# EAGLE design schema (EAGLE 6.1)
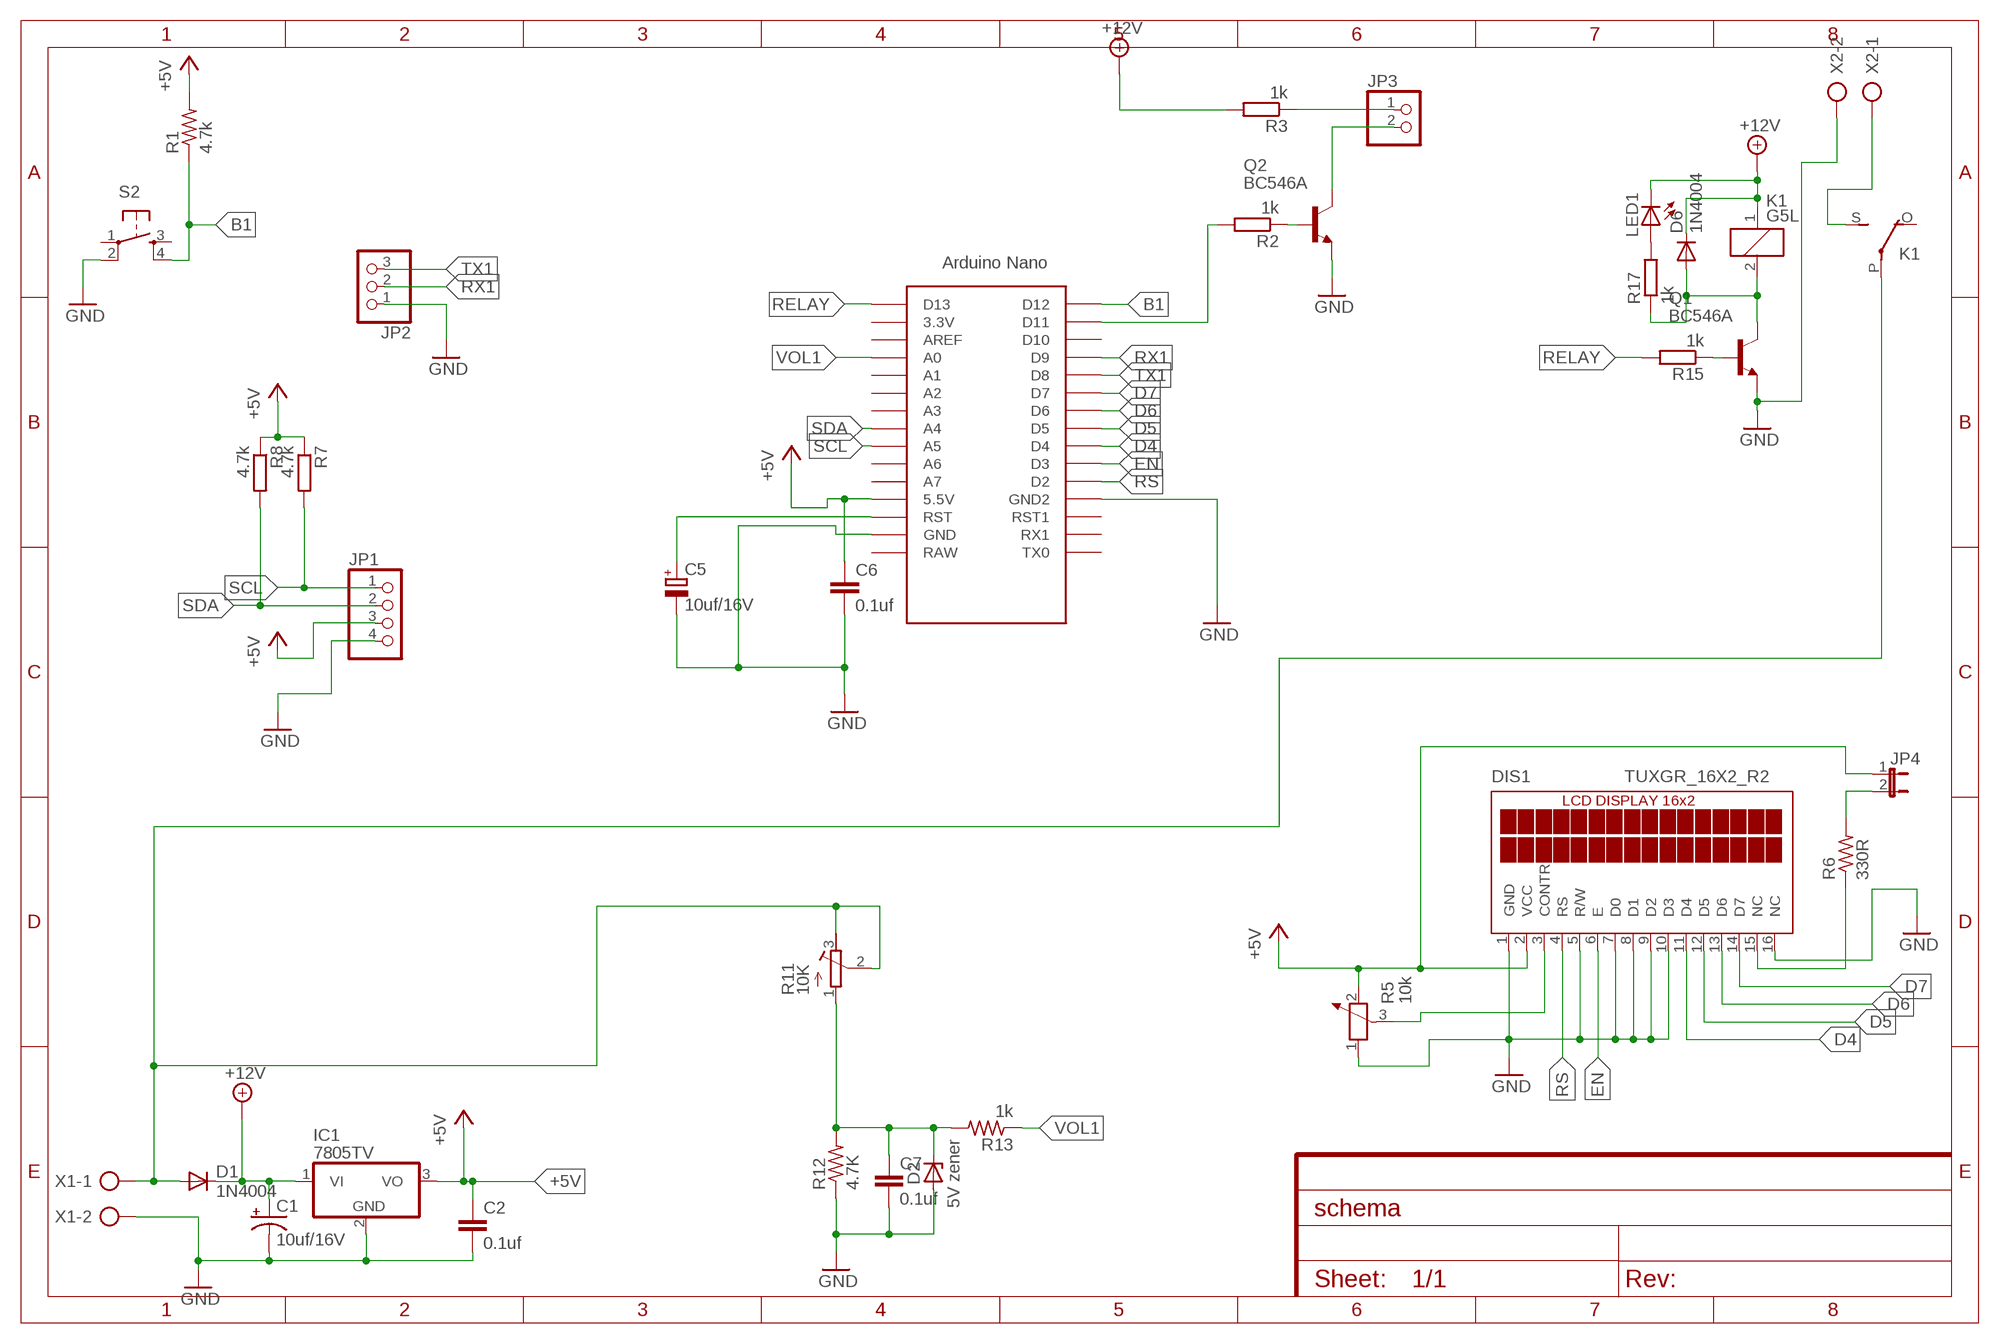
[diagram p0: schematic, sheet 1]

## Parts
C1  10uf/16V  CPOL-USE2.5-5  [E2,5-5]
C2  0.1uf  C-EU050-035X075  [C050-035X075]
C5  10uf/16V  CPOL-EUE2-5  [E2-5]
C6  0.1uf  C-EU050-035X075  [C050-035X075]
C7  0.1uf  C-EU050-025X075  [C050-025X075]
D1  1N4004  [DO41-10]
D2  1N4728  [DO41Z10]
D6  1N4004  [DO41-10]
DIS1  TUXGR_16X2_R2  [TUXGR_16X2_R2]
IC1  7805TV  [TO220V]
JP1  PINHD-1X4  [1X04]
JP2  PINHD-1X3  [1X03]
JP3  PINHD-1X2  [1X02]
JP4  JP1E  [JP1]
K1  G5L  [G5LE]
LED1  LED3MM  [LED3MM]
Q1  BC546A  [TO92-EBC]
Q2  BC546A  [TO92-EBC]
R1  4.7k  R-US_0207/10  [0207/10@1]
R2  1k  R-EU_0207/10  [0207/10@1]
R3  1k  R-EU_0207/10  [0207/10@1]
R5  10k  POTENTIOMETER_PT-10  [PT-10]
R6  330R  R-US_0207/10  [0207/10@1]
R7  4.7k  R-EU_0207/10  [0207/10@1]
R8  4.7k  R-EU_0207/10  [0207/10@1]
R11  10K  R-TRIMM3299W  [RTRIM3299W]
R12  4.7K  R-US_0207/10  [0207/10@1]
R13  1k  R-US_0207/10  [0207/10@1]
R15  1k  R-EU_0207/10  [0207/10@1]
R17  1k  R-EU_0207/5V  [0207/5V@1]
S2  TAC_SWITCHPTH  [TACTILE-PTH]
U$1  NANO  [NANO]
X1  AK500/2  [AK500/2]
X2  AK500/2  [AK500/2]

## Nets
+5V: C2.1 C6.1 DIS1.2(VCC) IC1.3(VO) JP1.3 JP4.1 R1.2 R5.2 R7.1 R8.1 U$1.5V(5.5V)
+12V: C1.+ D1.C D6.C IC1.1(VI) K1.1 LED1.K(C) R3.2
B1: R1.1 S2.4 U$1.D12
D4: DIS1.11(D4) U$1.D4
D5: DIS1.12(D5) U$1.D5
D6: DIS1.13(D6) U$1.D6
D7: DIS1.14(D7) U$1.D7
EN: DIS1.6(E) U$1.D3
FEEDER: D1.A K1.P(2:P) R11.2(S) R11.3(E) X1.1
GND: C1.- C2.2 C5.- C6.2 C7.2 D2.A DIS1.1(GND) DIS1.5(R/W) DIS1.7(D0) DIS1.8(D1) DIS1.9(D2) DIS1.10(D3) DIS1.16(NC) IC1.2(GND) JP1.4 JP2.1 Q1.E Q2.E R5.1 R12.1 S2.2 U$1.GND U$1.GND1(GND2) X1.2 X2.2
N$1: JP4.2 R6.2
N$2: D6.A K1.2 Q1.C R17.1
N$4: K1.S(2:S) X2.1
N$5: C7.1 D2.C R11.1(A) R12.2 R13.2
N$6: C5.+ U$1.RST
N$7: JP3.2 Q2.C
N$8: Q2.B R2.1
N$9: JP3.1 R3.1
N$10: DIS1.3(CONTR) R5.3
N$11: DIS1.15(NC) R6.1
N$12: R2.2 U$1.D11
N$17: Q1.B R15.1
N$24: LED1.A R17.2
RELAY: R15.2 U$1.D13
RS: DIS1.4(RS) U$1.D2
RX1: JP2.2 U$1.D9
SCL: JP1.1 R7.2 U$1.A5
SDA: JP1.2 R8.2 U$1.A4
TX1: JP2.3 U$1.D8
VOL1: R13.1 U$1.A0
Unconnected: K1.O(2:O) S2.1 S2.3 U$1.3.3V U$1.A1 U$1.A2 U$1.A3 U$1.A6 U$1.A7 U$1.AREF U$1.D10 U$1.ICSP1 U$1.ICSP2 U$1.ICSP3 U$1.ICSP4 U$1.ICSP5 U$1.ICSP6 U$1.RAW U$1.RST1 U$1.RX1 U$1.TX0

## Notes on the sheet
- 5V zener

## Library data of the parts
C1 = rcl:CPOL-US: POLARIZED CAPACITOR, American symbol
C2 C6 C7 = rcl:C-EU: CAPACITOR, European symbol
C5 = rcl:CPOL-EU: POLARIZED CAPACITOR, European symbol
D1 D6 = diode:1N4004: DIODE general purpose rectifier, 1 A
D2 = diode:1N4728: Z DIODE 3.3 V, 1W, 5 percent; VALUE: 5V zener
DIS1 = display-lcd:TUXGR_16X2_R2: Tuxgraphics LCD display 16x2 characters reflective, without background light Source: tuxgr_12x2_r2.pdf; OC_FARNELL: unknown; OC_NEWARK: unknown
IC1 = linear:78*: Positive VOLTAGE REGULATOR Source: http://cache.national.com/ds/LM/LM78L05.pdf http://www.fairchildsemi.com/ds/LM/LM7805.pdf
JP1 = pinhead:PINHD-1X4: PIN HEADER
JP2 = pinhead:PINHD-1X3: PIN HEADER
JP3 = pinhead:PINHD-1X2: PIN HEADER
JP4 = jumper:JP1E: JUMPER
K1 = relay:G5L: RELAY 1 x switch, 10 A/120 V AC, 8 A/30 V ADC, Omron; OC_FARNELL: unknown; OC_NEWARK: unknown
LED1 = led:LED: LED OSRAM: - CHIPLED LG R971, LG N971, LY N971, LG Q971, LY Q971, LO R971, LY R971 LH N974, LH R974 LS Q976, LO Q976, LY Q976 LO Q996 - Hyper CHIPLED LW Q18S LB Q993, LB Q99A, LB R99A - SideLED LS A670, LO A670, LY A670, LG A670, LP A670 LB A673, LV A673, LT A673, LW A673 LH A674 LY A675 LS A676, LA A676, LO A676, LY A676, LW A676 LS A679, LY A679, LG A679 - Hyper Micro SIDELED® LS Y876, LA Y876, LO Y876, LY Y876 LT Y87S - SmartLED LW L88C, LW L88S LB L89C, LB L89S, LG L890 LS L89K, LO L89K, LY L89K LS L896, LA L896, LO L896, LY L896 - TOPLED LS T670, LO T670, LY T670, LG T670, LP T670 LSG T670, LSP T670, LSY T670, LOP T670, LYG T670 LG T671, LOG T671, LSG T671 LB T673, LV T673, LT T673, LW T673 LH T674 LS T676, LA T676, LO T676, LY T676, LB T676, LH T676, LSB T676, LW T676 LB T67C, LV T67C, LT T67C, LS T67K, LO T67K, LY T67K, LW E67C LS E67B, LA E67B, LO E67B, LY E67B, LB E67C, LV E67C, LT E67C LW T67C LS T679, LY T679, LG T679 LS T770, LO T770, LY T770, LG T770, LP T770 LB T773, LV T773, LT T773, LW T773 LH T774 LS E675, LA E675, LY E675, LS T675 LS T776, LA T776, LO T776, LY T776, LB T776 LHGB T686 LT T68C, LB T68C - Hyper Mini TOPLED® LB M676 - Mini TOPLED Santana® LG M470 LS M47K, LO M47K, LY M47K Source: http://www.osram.convergy.de LUXEON: - LUMILED® LXK2-PW12-R00, LXK2-PW12-S00, LXK2-PW14-U00, LXK2-PW14-V00 LXK2-PM12-R00, LXK2-PM12-S00, LXK2-PM14-U00 LXK2-PE12-Q00, LXK2-PE12-R00, LXK2-PE12-S00, LXK2-PE14-T00, LXK2-PE14-U00 LXK2-PB12-K00, LXK2-PB12-L00, LXK2-PB12-M00, LXK2-PB14-N00, LXK2-PB14-P00, LXK2-PB14-Q00 LXK2-PR12-L00, LXK2-PR12-M00, LXK2-PR14-Q00, LXK2-PR14-R00 LXK2-PD12-Q00, LXK2-PD12-R00, LXK2-PD12-S00 LXK2-PH12-R00, LXK2-PH12-S00 LXK2-PL12-P00, LXK2-PL12-Q00, LXK2-PL12-R00 Source: www.luxeon.com KINGBRIGHT: KA-3528ASYC Source: www.kingbright.com
Q1 Q2 = transistor-npn:BC546*: NPN Transistor
R1 R6 R12 R13 = rcl:R-US_: RESISTOR, American symbol
R2 R3 R7 R8 R15 R17 = rcl:R-EU_: RESISTOR, European symbol
R5 = rcl:POTENTIOMETER_: Potentiometer
R11 = rcl:R-TRIMM: Trimm resistor
S2 = SparkFun-Retired:TAC_SWITCH: Momentary Switch Button commonly used for reset or general input. Spark Fun Electronics SKU : COM-00097 SMT- SWCH-08247
U$1 = Arduino-clone:NANO: Arduino Nano
X1 X2 = con-ptr500:AK500/2: CONNECTOR; OC_FARNELL: unknown; OC_NEWARK: unknown

## Net classes
0 default: width 0.8 mm, drill 0.8 mm, clearance 1.2 mm

## Board
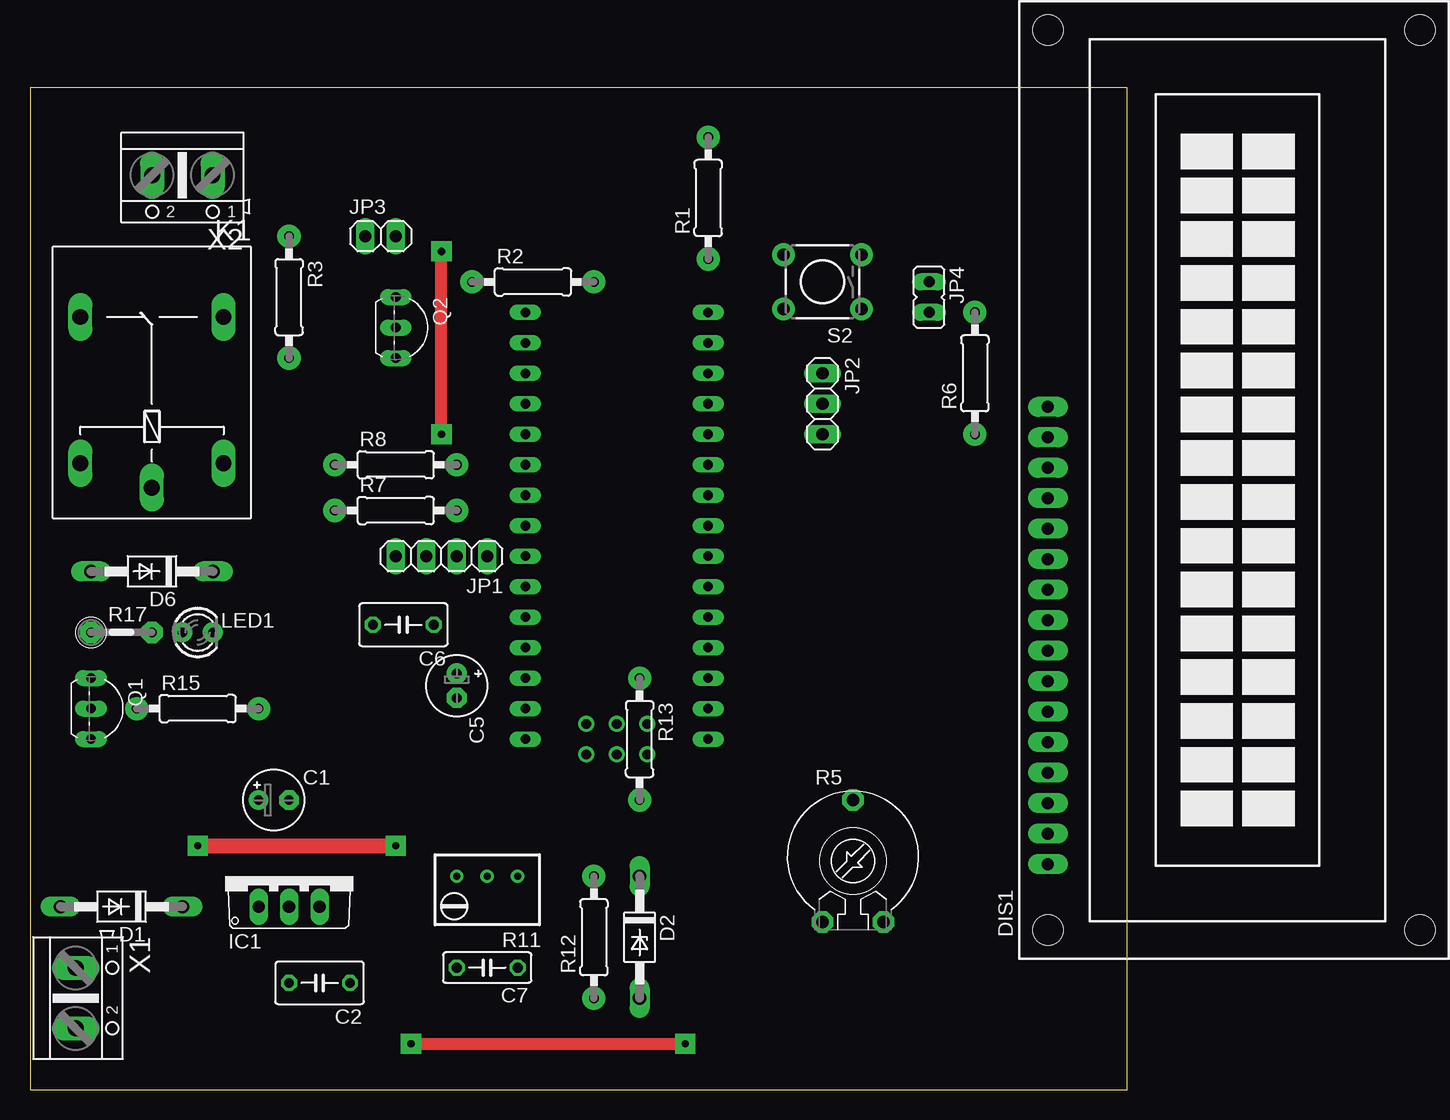
[diagram p1: board, top side]
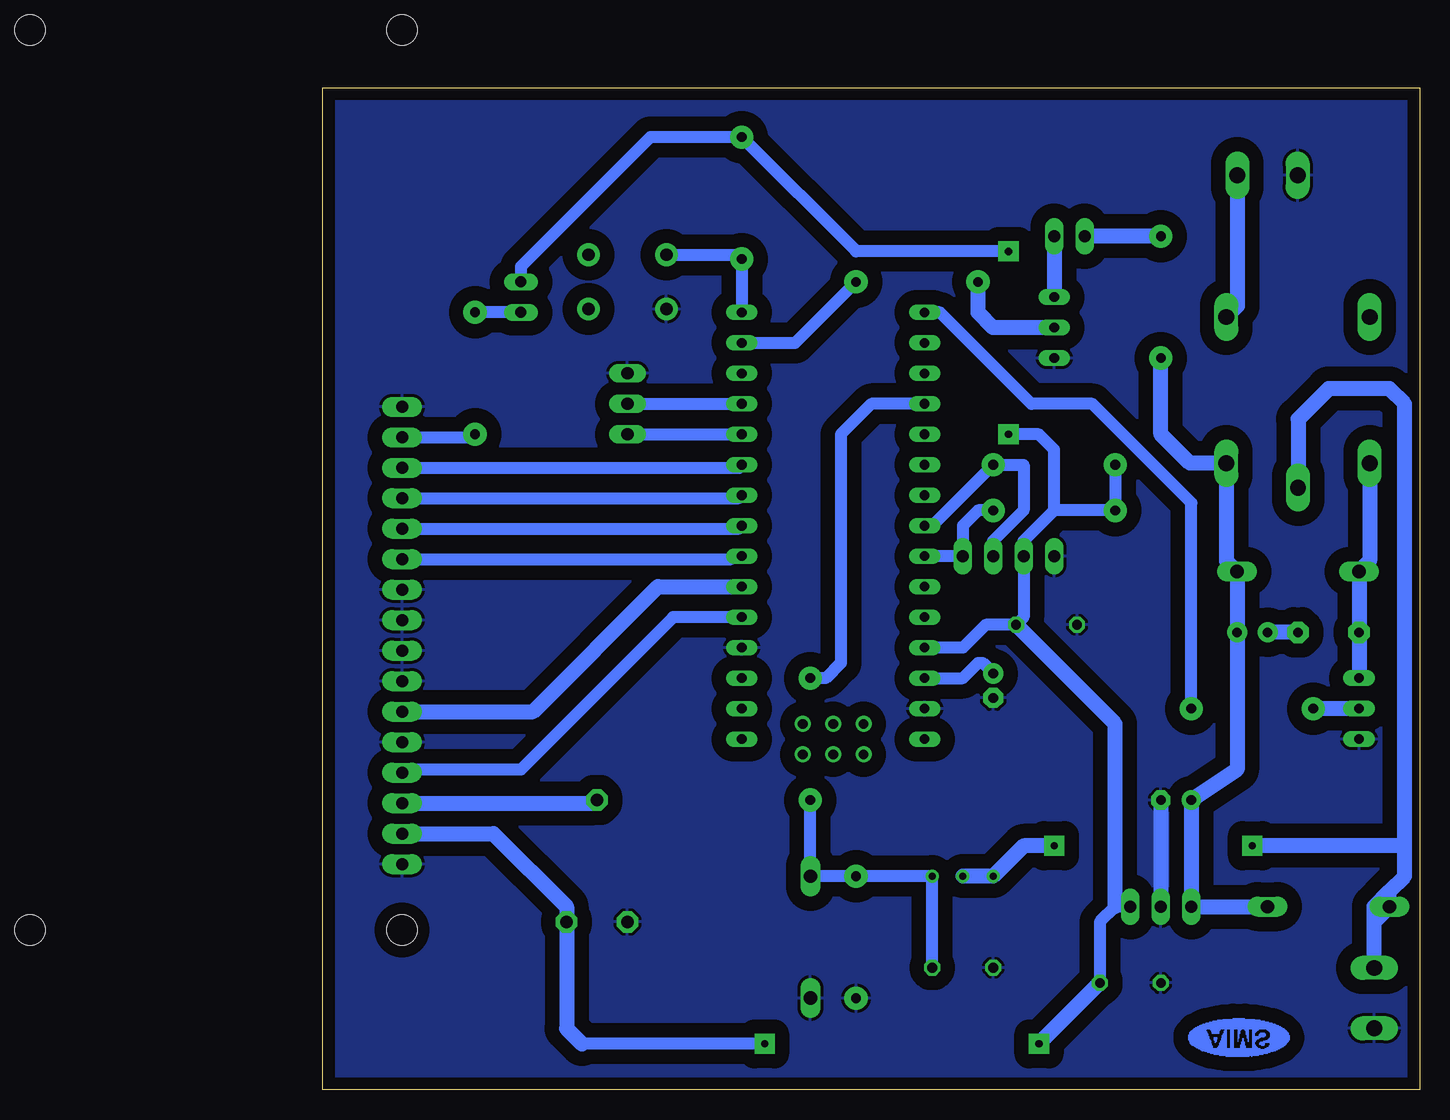
[diagram p2: board, bottom side, seen from below]

Size 91.42 x 83.49 mm. Coordinates in mm from the lower left corner, seen from the top.
Outline: 0,0 91.42,0 91.42,83.49 0,83.49 0,0
Copper layers (1*16): Top 0.035mm / dielectric 1.5mm / Bottom 0.035mm
Design rules: minimum track width 10mil, minimum drill 24mil, track to track 8mil, track to pad 8mil, pad to pad 8mil, via to via 8mil, smd to smd 8mil, copper to edge 40mil, drill to drill 8mil, minimum pad ring 10mil, minimum via ring 8mil, stop-mask expansion 4mil, vias tented up to drill 0mil, thermal gap 10mil

### Footprints (pad centres in the part's own frame; a part is rotated, then mirrored left to right if it is on the bottom)
E2,5-5 = drill 0.813 pad 1.6: + -1.27,0 | drill 0.813 pad 1.6 octagon: - 1.27,0
C050-035X075 = drill 0.813 octagon: 1 -2.54,0; 2 2.54,0
E2-5 = drill 0.813 pad 1.676: + -1.016,0 | drill 0.813 pad 1.676 octagon: - 1.016,0
C050-025X075 = drill 0.813 octagon: 1 -2.54,0; 2 2.54,0
DO41-10 = drill 1.118 long: A 5.08,0; C -5.08,0
DO41Z10 = drill 1.118 long: A 5.08,0; C -5.08,0
TUXGR_16X2_R2 = drill 1 pad 1.676 long: 1 -32,15.5; 2 -29.46,15.5; 3 -26.92,15.5; 4 -24.38,15.5; 5 -21.84,15.5; 6 -19.3,15.5; 7 -16.76,15.5; 8 -14.22,15.5; 9 -11.68,15.5; 10 -9.14,15.5; 11 -6.6,15.5; 12 -4.06,15.5; 13 -1.52,15.5; 14 1.02,15.5; 15 3.56,15.5; 16 6.1,15.5 | hole 2.5: -37.5,-15.5; 37.5,-15.5; -37.5,15.5; 37.5,15.5
TO220V = drill 1.016 long: 1 -2.54,-2.54; 2 0,-2.54; 3 2.54,-2.54
1X04 = drill 1.016 long: 1 -3.81,0; 2 -1.27,0; 3 1.27,0; 4 3.81,0
1X03 = drill 1.016 long: 1 -2.54,0; 2 0,0; 3 2.54,0
1X02 = drill 1.016 long: 1 -1.27,0; 2 1.27,0
JP1 = drill 0.914 long: 1 0,-1.27; 2 0,1.27
G5LE = drill 1.321 long: 1 -7.493,-5.969; 2 -7.493,5.969; O 4.699,5.969; P -9.525,0; S 4.699,-5.969
LED3MM = drill 0.813 pad 1.676: A -1.27,0; K 1.27,0
TO92-EBC = drill 0.813 long: B 0,-1.27; C -2.54,-1.27; E 2.54,-1.27
0207/10@1 = drill 0.813 pad 1.93: 1 -5.08,0; 2 5.08,0
PT-10 = drill 1.016 pad 1.778 octagon: 1 -2.54,-5.08; 2 2.54,-5.08; 3 0,5.08
RTRIM3299W = drill 0.61: 1 1.27,-2.54; 2 1.27,0; 3 1.27,2.54
0207/5V@1 = drill 0.813 pad 1.778 octagon: 1 -2.54,0; 2 2.54,0
TACTILE-PTH = drill 1.016 pad 1.88: 1 -3.251,2.261; 2 3.251,2.261; 3 -3.251,-2.261; 4 3.251,-2.261
NANO = drill 0.8 long: 3.3V -10.16,24.13; 5V -10.16,-1.27; A0 -10.16,19.05; A1 -10.16,16.51; A2 -10.16,13.97; A3 -10.16,11.43; A4 -10.16,8.89; A5 -10.16,6.35; A6 -10.16,3.81; A7 -10.16,1.27; AREF -10.16,21.59; D2 5.08,1.27; D3 5.08,3.81; D4 5.08,6.35; D5 5.08,8.89; D6 5.08,11.43; D7 5.08,13.97; D8 5.08,16.51; D9 5.08,19.05; D10 5.08,21.59; D11 5.08,24.13; D12 5.08,26.67; D13 -10.16,26.67; GND -10.16,-6.35; GND1 5.08,-1.27; RAW -10.16,-8.89; RST -10.16,-3.81; RST1 5.08,-3.81; RX1 5.08,-6.35; TX0 5.08,-8.89 | drill 0.8: ICSP1 -5.08,-10.16; ICSP2 -5.08,-7.62; ICSP3 -2.54,-10.16; ICSP4 -2.54,-7.62; ICSP5 0,-10.16; ICSP6 0,-7.62
AK500/2 = drill 1.321 long: 1 -2.515,0; 2 2.515,0

### Placement (x,y rotation side)
C1  20.32,24.13 0 top
C2  24.13,8.89 180 top
C5  35.56,33.66 270 top
C6  31.11,38.73 180 top
C7  38.1,10.16 180 top
D1  7.62,15.24 180 top
D2  50.8,12.7 270 top
D6  10.16,43.18 180 top
DIS1  100.33,50.8 90 top
IC1  21.59,17.78 0 top
JP1  34.29,44.45 180 top
JP2  66.04,57.15 270 top
JP3  29.21,71.12 0 top
JP4  74.93,66.04 180 top
K1  10.16,59.69 90 top
LED1  13.97,38.1 0 top
Q1  6.35,31.75 270 top
Q2  31.75,63.5 270 top
R1  56.52,74.3 90 top
R2  41.91,67.31 0 top
R3  21.59,66.04 270 top
R5  68.58,19.05 0 top
R6  78.74,59.69 90 top
R7  30.48,48.26 0 top
R8  30.48,52.07 0 top
R11  38.1,16.51 90 top
R12  46.99,12.7 90 top
R13  50.8,29.21 270 top
R15  13.97,31.75 0 top
R17  7.62,38.1 0 top
S2  66.04,67.31 180 top
U$1  51.44,38.1 0 top
X1  3.81,7.62 270 top
X2  12.7,76.2 180 top

### Tracks (layer width: path | path; a pad name or v marks a point on that pad's centre or on a via)
+5V  (via drill 0.6 pad 1.68)
  Top 1.016: v34.29,54.61 v34.29,69.85 | v31.75,3.81 v54.61,3.81
  Bottom 1.016: IC1.3 25.4,15.24 26.67,13.97 C2.1 | R8.1 R7.1 30.48,48.26 | 30.48,48.26 33.02,45.72 JP1.3 33.02,39.37 C6.1 36.2,38.73 38.1,36.83 U$1.5V | 30.48,48.26 30.48,53.34 31.75,54.61 v34.29,54.61 | v34.29,69.85 46.99,69.85 R1.2 64.14,79.38 74.93,68.58 JP4.1 | v54.61,3.81 69.85,3.81
  Bottom 1.27: DIS1.2 77.22,21.34 71.12,15.24 R5.2 71.12,5.08 69.85,3.81 | 25.4,15.24 25.4,30.48 C6.1 | v31.75,3.81 C2.1
+12V
  Bottom 1.27: D1.C IC1.1 C1.+ 15.24,26.67 LED1.K D6.C 16.13,44.07 K1.1 19.18,52.2 21.59,54.61 R3.2
B1
  Bottom 1.016: U$1.D12 R1.1 56.87,69.57 S2.4
D4
  Bottom 1.016: DIS1.11 57.4,44.2 57.15,44.45 U$1.D4
D5
  Bottom 1.016: DIS1.12 56.77,46.74 U$1.D5
D6
  Bottom 1.016: DIS1.13 56.77,49.28 U$1.D6
D7
  Bottom 1.016: DIS1.14 56.77,51.82 U$1.D7
EN
  Bottom 1.27: DIS1.6 73.91,31.5 63.5,41.91 57.15,41.91 U$1.D3 55.88,41.91
FEEDER  (via drill 0.6 pad 1.68)
  Top 1.27: v13.97,20.32 v30.48,20.32
  Bottom 1.27: X1.1 3.81,13.97 | 3.81,13.97 D1.A 2.54,16.51 | 2.54,16.51 1.27,17.78 1.27,20.32 | 1.27,20.32 1.27,57.15 2.54,58.42 7.62,58.42 10.16,55.88 10.16,50.8 K1.P 10.16,49.53 | 3.81,13.97 3.81,15.24 2.54,16.51 | 1.27,20.32 v13.97,20.32 | v30.48,20.32 33.02,20.32 R11.3 R11.2
GND
  Bottom 1.27: C1.- IC1.2
  pour Bottom: 0,83.82 0,0 91.44,0 91.44,83.82
N$1
  Bottom 1.016: JP4.2 R6.2
N$2
  Bottom 1.27: K1.2 4.19,44.07 D6.A R17.1 Q1.C
N$4
  Bottom 1.27: X2.1 15.21,65.3 K1.S
N$5
  Bottom 1.016: C7.1 R11.1 R12.2 D2.C R13.2
N$6
  Bottom 1.016: U$1.RST 38.1,34.29 36.83,35.56 36.45,35.56 C5.+
N$7
  Bottom 1.27: JP3.2 Q2.C
N$8
  Bottom 1.27: Q2.B 35.56,63.5 36.83,64.77 R2.1
N$9
  Bottom 1.27: R3.1 JP3.1
N$10
  Bottom 1.27: DIS1.3 68.83,23.88 R5.3
N$11
  Bottom 1.016: DIS1.15 78.99,54.36 R6.1
N$12
  Bottom 1.016: U$1.D11 52.07,62.23 R2.2
N$17
  Bottom 1.27: Q1.B R15.1
N$24
  Bottom 1.27: R17.2 LED1.A
RELAY
  Bottom 1.016: U$1.D13 40.01,64.77 32.38,57.15 27.3,57.15 19.05,48.9 R15.2
RS
  Bottom 1.016: U$1.D2 62.23,39.37 74.93,26.67 84.58,26.67 DIS1.4
RX1
  Bottom 1.016: JP2.2 U$1.D9
SCL
  Bottom 1.016: R7.2 36.83,48.26 38.1,46.99 JP1.1 U$1.A5
SDA
  Bottom 1.016: U$1.A4 40.64,46.99 R8.2 33.02,52.07 33.02,48.26 35.56,45.72 JP1.2
TX1
  Bottom 1.016: JP2.3 U$1.D8
VOL1
  Bottom 1.016: U$1.A0 45.72,57.15 48.26,54.61 48.26,35.56 49.53,34.29 R13.1
(copper drawn outside any net)
  shapes: Bottom area x186